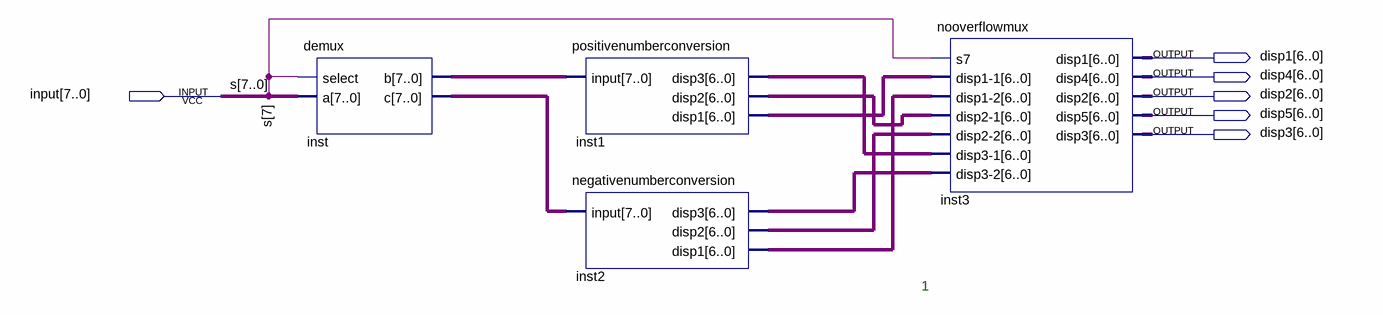
[diagram p0: schematic sheet]
// Quartus schematic numberconverter.bdf as structural Verilog: 4 symbols, 6 pins
module numberconverter (
  input  [7:0] \input ,
  output [6:0] disp1,
  output [6:0] disp4,
  output [6:0] disp2,
  output [6:0] disp5,
  output [6:0] disp3
);

  wire [6:0] inst1_disp1, inst1_disp2, inst1_disp3, inst2_disp1, inst2_disp2, inst2_disp3;
  wire [7:0] inst_b, inst_c;

  demux inst (.select(\input [7]), .a(\input ), .b(inst_b), .c(inst_c));
  positivenumberconversion inst1 (.\input (inst_b), .disp3(inst1_disp3), .disp2(inst1_disp2), .disp1(inst1_disp1));
  negativenumberconversion inst2 (.\input (inst_c), .disp3(inst2_disp3), .disp2(inst2_disp2), .disp1(inst2_disp1));
  nooverflowmux inst3 (
    .s7(\input [7]), .\disp1-1 (inst1_disp1), .\disp1-2 (inst2_disp1), .\disp2-1 (inst1_disp2),
    .\disp2-2 (inst2_disp2), .\disp3-1 (inst1_disp3), .\disp3-2 (inst2_disp3), .disp1(disp1), .disp4(disp4),
    .disp2(disp2), .disp5(disp5), .disp3(disp3));

  // Other names for the same wires on the sheet: s[7:0] = \input 

  // Notes on the sheet:
  //   1
endmodule
